# EAGLE schematic rgb-lcd (EAGLE 7.7.0)
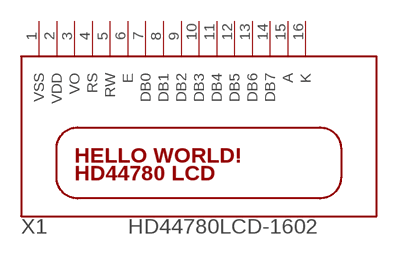
[diagram p0: schematic, sheet 1]

## Parts
X1  HD44780LCD-1602  [LCD1602]
Unconnected: X1.1(VSS) X1.2(VDD) X1.3(VO) X1.4(RS) X1.5(RW) X1.6(E) X1.7(DB0) X1.8(DB1) X1.9(DB2) X1.10(DB3) X1.11(DB4) X1.12(DB5) X1.13(DB6) X1.14(DB7) X1.15(A) X1.16(K)

## Library data of the parts
X1 = adafruit:HD44780LCD: HD44780 LCD Standard character type LCDs, available in sizes from 8x1 to 40x4!